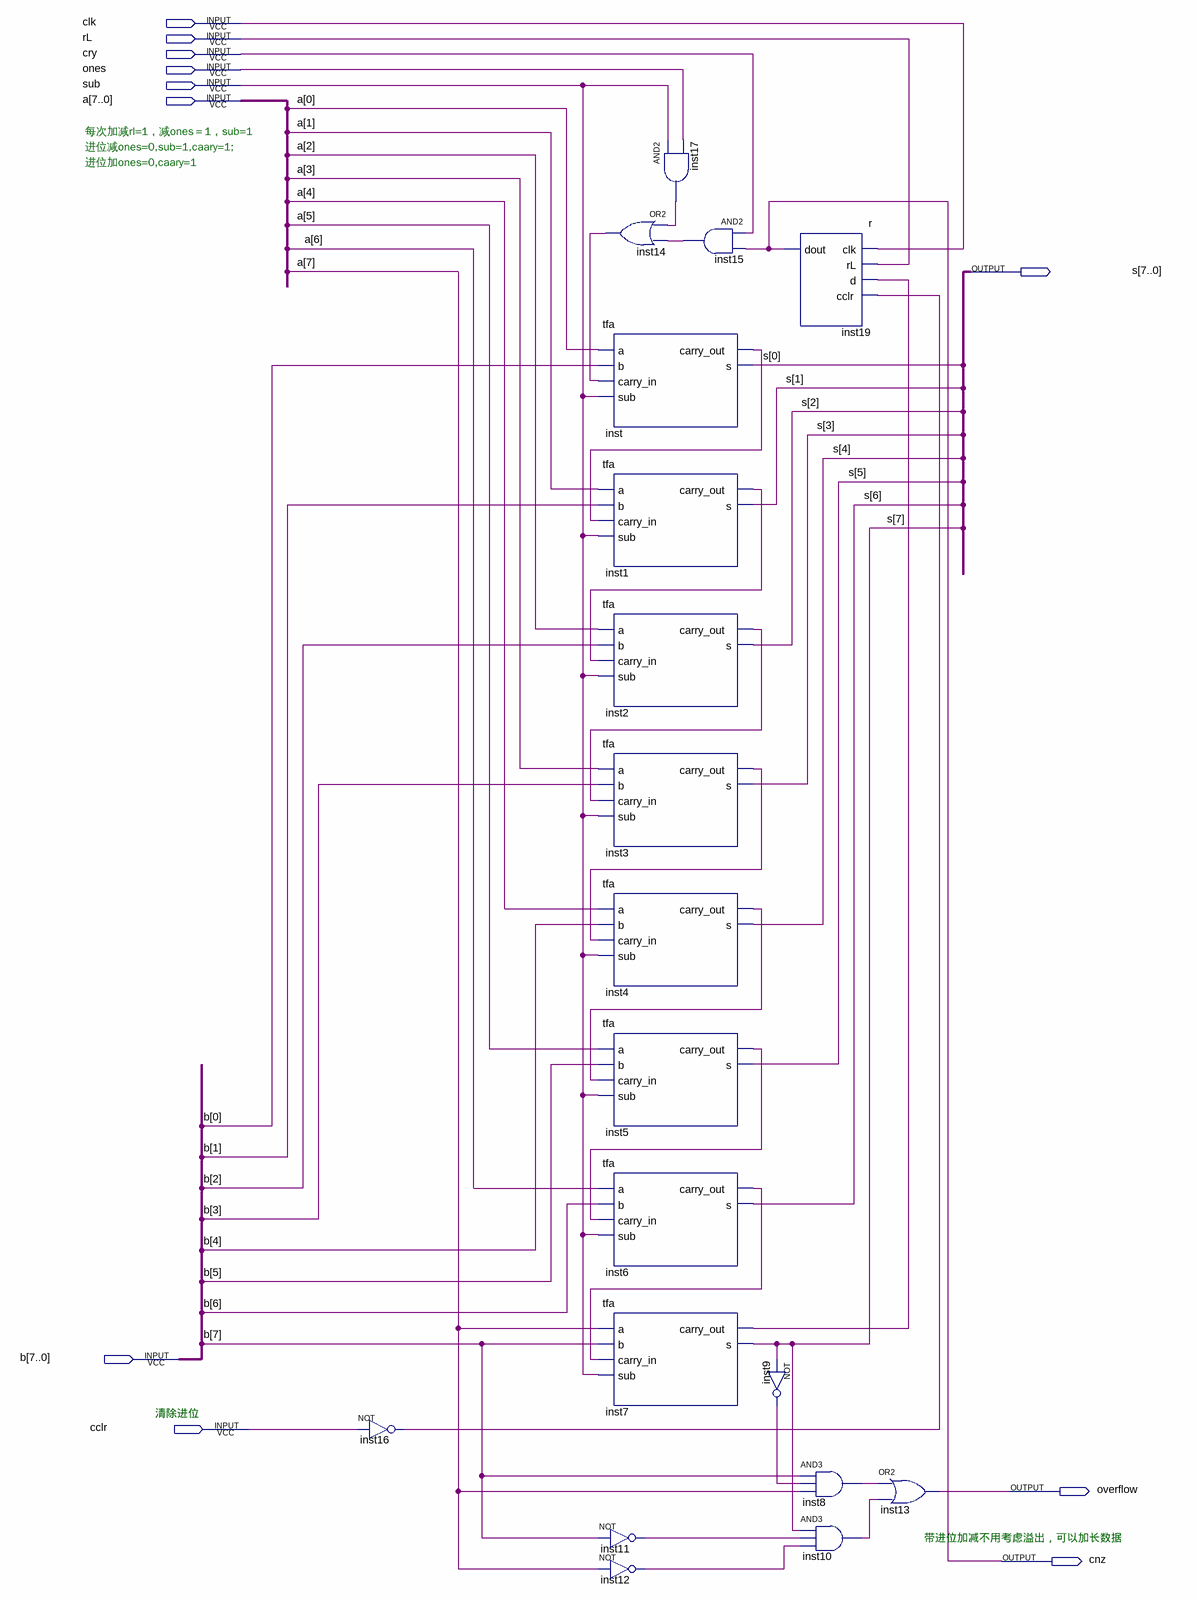
[diagram p0: schematic sheet]
// Quartus schematic a_s.bdf as structural Verilog: 19 symbols, 11 pins
module a_s (
  input  clk,
  input  rL,
  input  cry,
  input  ones,
  input  sub,
  input  [7:0] a,
  input  [7:0] b,
  input  cclr,
  output [7:0] s,
  output overflow,
  output cnz
);

  wire inst1_carry_out, inst2_carry_out, inst3_carry_out, inst4_carry_out, inst5_carry_out, inst6_carry_out,
       inst7_carry_out, inst8_out, inst9_out, inst10_out, inst11_out, inst12_out, inst14_out, inst15_out,
       inst16_out, inst17_out, inst_carry_out;

  not inst16 (inst16_out, cclr);
  and inst17 (inst17_out, sub, ones);
  or inst14 (inst14_out, inst17_out, inst15_out);
  tfa inst (.a(a[0]), .b(b[0]), .carry_in(inst14_out), .sub(sub), .carry_out(inst_carry_out), .s(s[0]));
  tfa inst1 (.a(a[1]), .b(b[1]), .carry_in(inst_carry_out), .sub(sub), .carry_out(inst1_carry_out), .s(s[1]));
  tfa inst2 (.a(a[2]), .b(b[2]), .carry_in(inst1_carry_out), .sub(sub), .carry_out(inst2_carry_out), .s(s[2]));
  tfa inst3 (.a(a[3]), .b(b[3]), .carry_in(inst2_carry_out), .sub(sub), .carry_out(inst3_carry_out), .s(s[3]));
  tfa inst4 (.a(a[4]), .b(b[4]), .carry_in(inst3_carry_out), .sub(sub), .carry_out(inst4_carry_out), .s(s[4]));
  tfa inst5 (.a(a[5]), .b(b[5]), .carry_in(inst4_carry_out), .sub(sub), .carry_out(inst5_carry_out), .s(s[5]));
  tfa inst6 (.a(a[6]), .b(b[6]), .carry_in(inst5_carry_out), .sub(sub), .carry_out(inst6_carry_out), .s(s[6]));
  tfa inst7 (.a(a[7]), .b(b[7]), .carry_in(inst6_carry_out), .sub(sub), .carry_out(inst7_carry_out), .s(s[7]));
  not inst11 (inst11_out, b[7]);
  not inst12 (inst12_out, a[7]);
  and inst15 (inst15_out, cry, cnz);
  not inst9 (inst9_out, s[7]);
  r inst19 (.clk(clk), .rL(rL), .d(inst7_carry_out), .cclr(inst16_out), .dout(cnz));
  and inst8 (inst8_out, b[7], inst9_out, a[7]);
  and inst10 (inst10_out, s[7], inst11_out, inst12_out);
  or inst13 (overflow, inst8_out, inst10_out);

  // Notes on the sheet:
  //   每次加减rl=1，减ones＝1，sub=1
  //   进位减ones=0,sub=1,caary=1;
  //   进位加ones=0,caary=1
  //   清除进位
  //   带进位加减不用考虑溢出，可以加长数据
endmodule
